# Altium schematic sheet Power.SchDoc: Power
size A; Author: Craig Hesling; DrawnBy: Craig Hesling; Revision: 1
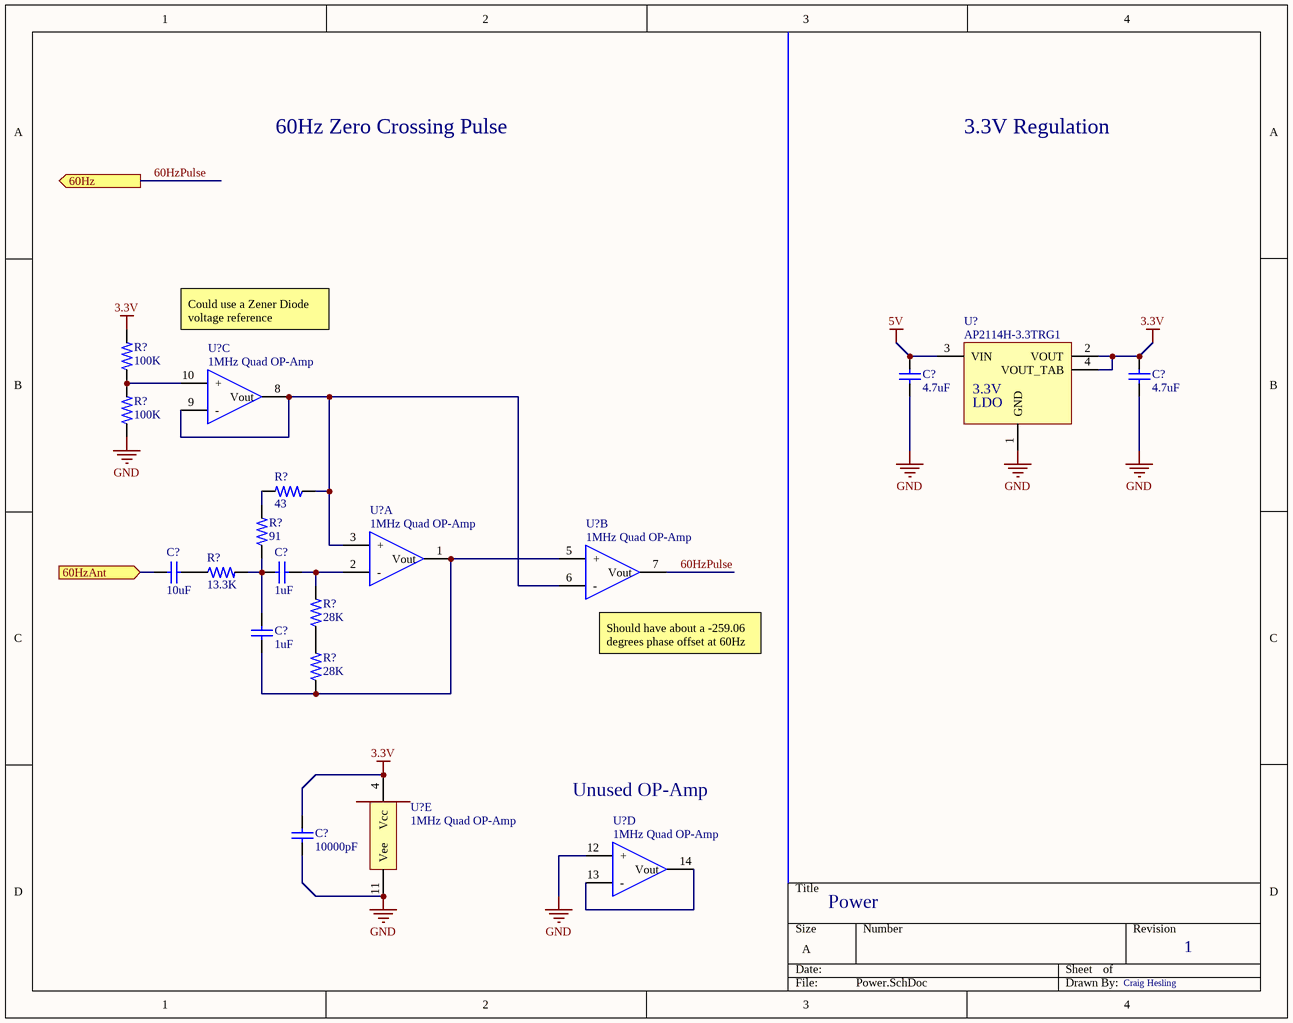
[diagram p0: Power.SchDoc]

## Parts
(Parts that share a designator on the sheet are numbered #1, #2 ... from top to bottom, then left to right.)
C?#1  4.7uF  [CAPC3216X18L - CAP1206 1.8MM TALL]
C?#2  4.7uF  [CAPC3216X18L - CAP1206 1.8MM TALL]
C?#3  10uF  [CAPC3225X28L - CAP1210 2.79mm Tall]
C?#4  1uF  [CAPC1608X09L - CAP0603]
C?#5  1uF  [CAPC1608X09L - CAP0603]
C?#6  10000pF  [CAPC1608X09L - CAP0603]
R?#1  100K  [RESC1608X06L - RES0603]
R?#2  100K  [RESC1608X06L - RES0603]
R?#3  43  [RESC1608X06L - RES0603]
R?#4  91  [RESC1608X06L - RES0603]
R?#5  13.3K  [RESC1608X06L - RES0603]
R?#6  28K  [RESC1608X06L - RES0603]
R?#7  28K  [RESC1608X06L - RES0603]
U?#1  1MHz Quad OP-Amp  [SOIC127P600X175-14L]  (part C of 5)
U?#2  AP2114H-3.3TRG1  [SOT230P700X180-4L]
U?#3  1MHz Quad OP-Amp  [SOIC127P600X175-14L]  (part A of 5)
U?#4  1MHz Quad OP-Amp  [SOIC127P600X175-14L]  (part B of 5)
U?#5  1MHz Quad OP-Amp  [SOIC127P600X175-14L]  (part E of 5)
U?#6  1MHz Quad OP-Amp  [SOIC127P600X175-14L]  (part D of 5)

## Ports
60Hz (out), 60HzAnt (in)

## Nets
3.3V: C?#2.2 C?#6.2 R?#1.2 U?#2.2(VOUT) U?#2.4(VOUT_TAB) U?#5.4(Vcc)
5V: C?#1.2 U?#2.3(VIN)
GND: C?#1.1 C?#2.1 C?#6.1 R?#2.1 U?#2.1(GND) U?#5.11(Vee) U?#6.12(+)
60HzAnt: C?#3.1 ; port 60HzAnt
60HzPulse: U?#4.7(Vout) ; port 60Hz
NetC?#3_2: C?#3.2 R?#5.1
NetC?#4_1: C?#4.1 R?#6.2 U?#3.2(-)
NetC?#4_2: C?#4.2 C?#5.2 R?#4.1 R?#5.2
NetC?#5_1: C?#5.1 R?#7.1 U?#3.1(Vout) U?#4.5(+)
NetR?#1_1: R?#1.1 R?#2.2 U?#1.10(+)
NetR?#3_1: R?#3.1 U?#1.8(Vout) U?#1.9(-) U?#3.3(+) U?#4.6(-)
NetR?#3_2: R?#3.2 R?#4.2
NetR?#6_1: R?#6.1 R?#7.2
NetU?#6_13: U?#6.13(-) U?#6.14(Vout)

## Notes on the sheet
- 60Hz Zero Crossing Pulse
- 3.3V Regulation
- Could use a Zener Diode voltage reference
- (near U?#4) Should have about a -259.06 degrees phase offset at 60Hz
- Unused OP-Amp
- (in symbol AP2114H-3.3TRG1) 3.3V; LDO

## Library data of the parts
C?#1 C?#2 = CAP1206 4.7uF 10% 25V X5R: SMT 1206 Ceramic Capacitor; TempCoeff: X5R; Tolerance: 10%; Voltage: 25V; Value: 4.7uF; Supplier 1: Digi-Key; Supplier Part Number 1: 587-1336-1-ND
C?#3 = CAP1210 10uF 10% 25V X7R: SMT 1210 Ceramic Capacitor; TempCoeff: X7R; Tolerance: 10%; Voltage: 25V; Value: 10uF; Supplier 1: Digi-Key; Supplier 2: Digi-Key; Supplier Part Number 1: 587-2226-1-ND; Supplier Part Number 2: 732-7708-1-ND
C?#4 C?#5 = CAP0603 1uF 10% 10V X7R: SMT 0603 Ceramic Capacitor; TempCoeff: X7R; Tolerance: 10%; Voltage: 10V; Value: 1uF; Supplier 1: Digi-Key; Supplier Part Number 1: 1276-1946-1-ND; Supplier 2: Digi-Key; Supplier Part Number 2: 399-3118-1-ND
C?#6 = CAP0603 10000pF 10% 50V X7R: SMT 0603 Ceramic Capacitor; TempCoeff: X7R; Tolerance: 10%; Voltage: 50V; Value: 10000pF; Supplier 1: Digi-Key; Supplier 2: Digi-Key; Supplier 3: Digi-Key; Supplier Part Number 1: 478-1215-1-ND; Supplier Part Number 2: 311-1080-1-ND; Supplier Part Number 3: 490-1494-1-ND
R?#1 R?#2 = RES0603 100K 1% 1/10W: SMT 0603 Ceramic Resistor; Power: 1/10W; Tolerance: 1%; Value: 100K; Supplier 1: Digi-Key; Supplier Part Number 1: 311-100KHRCT-ND
R?#3 = RES0603 43 1% 1/10W: SMT 0603 Ceramic Resistor; Power: 1/10W; Tolerance: 1%; Value: 43; Supplier 1: Digi-Key; Supplier Part Number 1: 311-43.0HRCT-ND; Supplier 2: Digi-Key; Supplier Part Number 2: P43.0HCT-ND
R?#4 = RES0603 91 1% 1/10W: SMT 0603 Ceramic Resistor; Power: 1/10W; Tolerance: 1%; Value: 91; Supplier 1: Digi-Key; Supplier 2: Digi-Key; Supplier 3: Digi-Key; Supplier Part Number 1: 311-91.0HRCT-ND; Supplier Part Number 2: 541-91.0HCT-ND; Supplier Part Number 3: RHM91CFCT-ND
R?#5 = RES0603 13.3K 1% 1/10W: SMT 0603 Ceramic Resistor; Power: 1/10W; Tolerance: 1%; Value: 13.3K; Supplier 1: Digi-Key; Supplier 2: Digi-Key; Supplier Part Number 1: 311-13.3KHRCT-ND; Supplier Part Number 2: P13.3KHCT-ND
R?#6 R?#7 = RES0603 28K 0.1% 1/10W: SMT 0603 Ceramic Resistor; Power: 1/10W; Tolerance: 0.1%; Value: 28K; Supplier 1: Digi-Key; Supplier 2: Digi-Key; Supplier Part Number 1: YAG4680CT-ND; Supplier Part Number 2: P28KDBCT-ND
U?#1 U?#3-U?#6 = LM324DR2G: ON Semi LM324DR2G 1MHz Quad OP-Amp; Supplier 1: Digi-Key; Supplier Part Number 1: LM324DR2GOSCT-ND
U?#2 = AP2114H-3.3TRG1: AP2114 3.3V Fixed LDO Regulator; Supplier 1: Digi-Key; Supplier Part Number 1: AP2114H-3.3TRG1DICT-ND